# EAGLE design RefrigeradorLG (EAGLE 7.3.0)
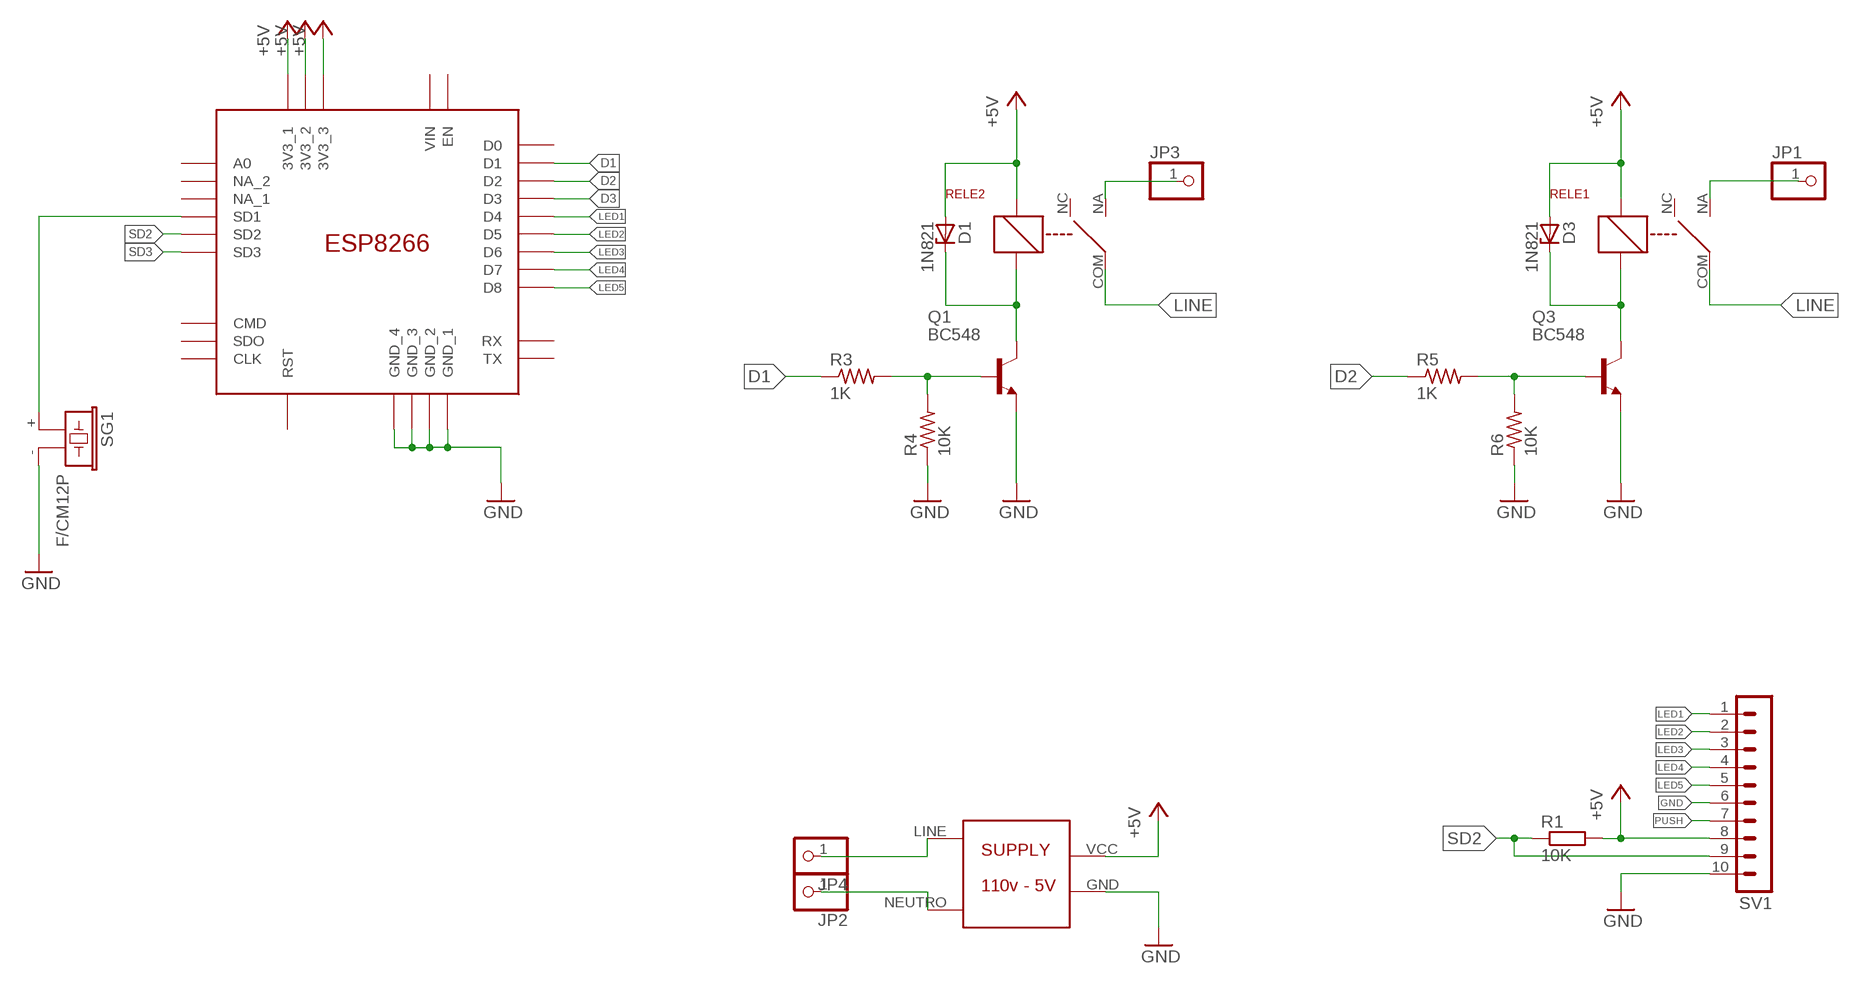
[diagram p0: schematic, sheet 1]

## Parts
D1  1N821  [DO35Z10]
D3  1N821  [DO35Z10]
ESP8266  ESP8266  [ESP8266]
JP1  PINHD-1X1  [1X01]
JP2  PINHD-1X1  [1X01]
JP3  PINHD-1X1  [1X01]
JP4  PINHD-1X1  [1X01]
Q1  BC548  [TO92-EBC]
Q3  BC548  [TO92-EBC]
R1  10K  R-EU_0204/7  [0204/7]
R3  1K  R-US_0204/7  [0204/7]
R4  10K  R-US_0204/7  [0204/7]
R5  1K  R-US_0204/7  [0204/7]
R6  10K  R-US_0204/7  [0204/7]
RELE1  RAS0510  [RAS0510]
RELE2  RAS0510  [RAS0510]
SG1  F/CM12P  [F/CM12P]
SV1  MA10-1  [MA10-1]
U$1  SUPPLY5V  [SUPPLY5V]

## Nets
+5V: D1.A D3.A ESP8266.3V3_1 ESP8266.3V3_2 ESP8266.3V3_3 R1.2 RELE1.B1 RELE2.B1 SV1.8 U$1.VCC
D1: ESP8266.D1 R3.1
D2: ESP8266.D2 R5.1
D3: ESP8266.D3
GND: ESP8266.GND_1 ESP8266.GND_2 ESP8266.GND_3 ESP8266.GND_4 Q1.E Q3.E R4.1 R6.1 SG1.- SV1.6 SV1.10 U$1.GND
LED1: ESP8266.D4 SV1.1
LED2: ESP8266.D5 SV1.2
LED3: ESP8266.D6 SV1.3
LED4: ESP8266.D7 SV1.4
LED5: ESP8266.D8 SV1.5
LINE: JP4.1 RELE1.COM RELE2.COM U$1.LINE
N$1: ESP8266.SD1 SG1.+
N$4: JP2.1 U$1.NEUTRO
N$5: Q1.B R3.2 R4.2
N$6: D1.C Q1.C RELE2.B2
N$7: Q3.B R5.2 R6.2
N$10: D3.C Q3.C RELE1.B2
N$11: JP3.1 RELE2.NA
N$14: JP1.1 RELE1.NA
PUSH: SV1.7
SD2: ESP8266.SD2 R1.1 SV1.9
SD3: ESP8266.SD3
Unconnected: ESP8266.A0 ESP8266.CLK ESP8266.CMD ESP8266.D0 ESP8266.EN ESP8266.NA_1 ESP8266.NA_2 ESP8266.RST ESP8266.RX ESP8266.SDO ESP8266.TX ESP8266.VIN RELE1.NC RELE2.NC

## Library data of the parts
D1 D3 = diode:1N821: Reference DIODE temperature compensated, 6,2 V
ESP8266 = Fortech:ESP8266: Microprocesor WiFi ESP8266
JP1-JP4 = pinhead:PINHD-1X1: PIN HEADER
Q1 Q3 = transistor-npn:BC548*: NPN Transistor
R1 = resistor:R-EU_: RESISTOR, European symbol
R3-R6 = resistor:R-US_: RESISTOR, American symbol
RELE1 RELE2 = E-Lab:RAS0510
SG1 = buzzer:F/CM12P: BUZZER Source: Buerklin; OC_FARNELL: unknown; OC_NEWARK: unknown
SV1 = con-lstb:MA10-1: PIN HEADER; OC_FARNELL: unknown; OC_NEWARK: unknown
U$1 = E-Lab:SUPPLY5V

## Board
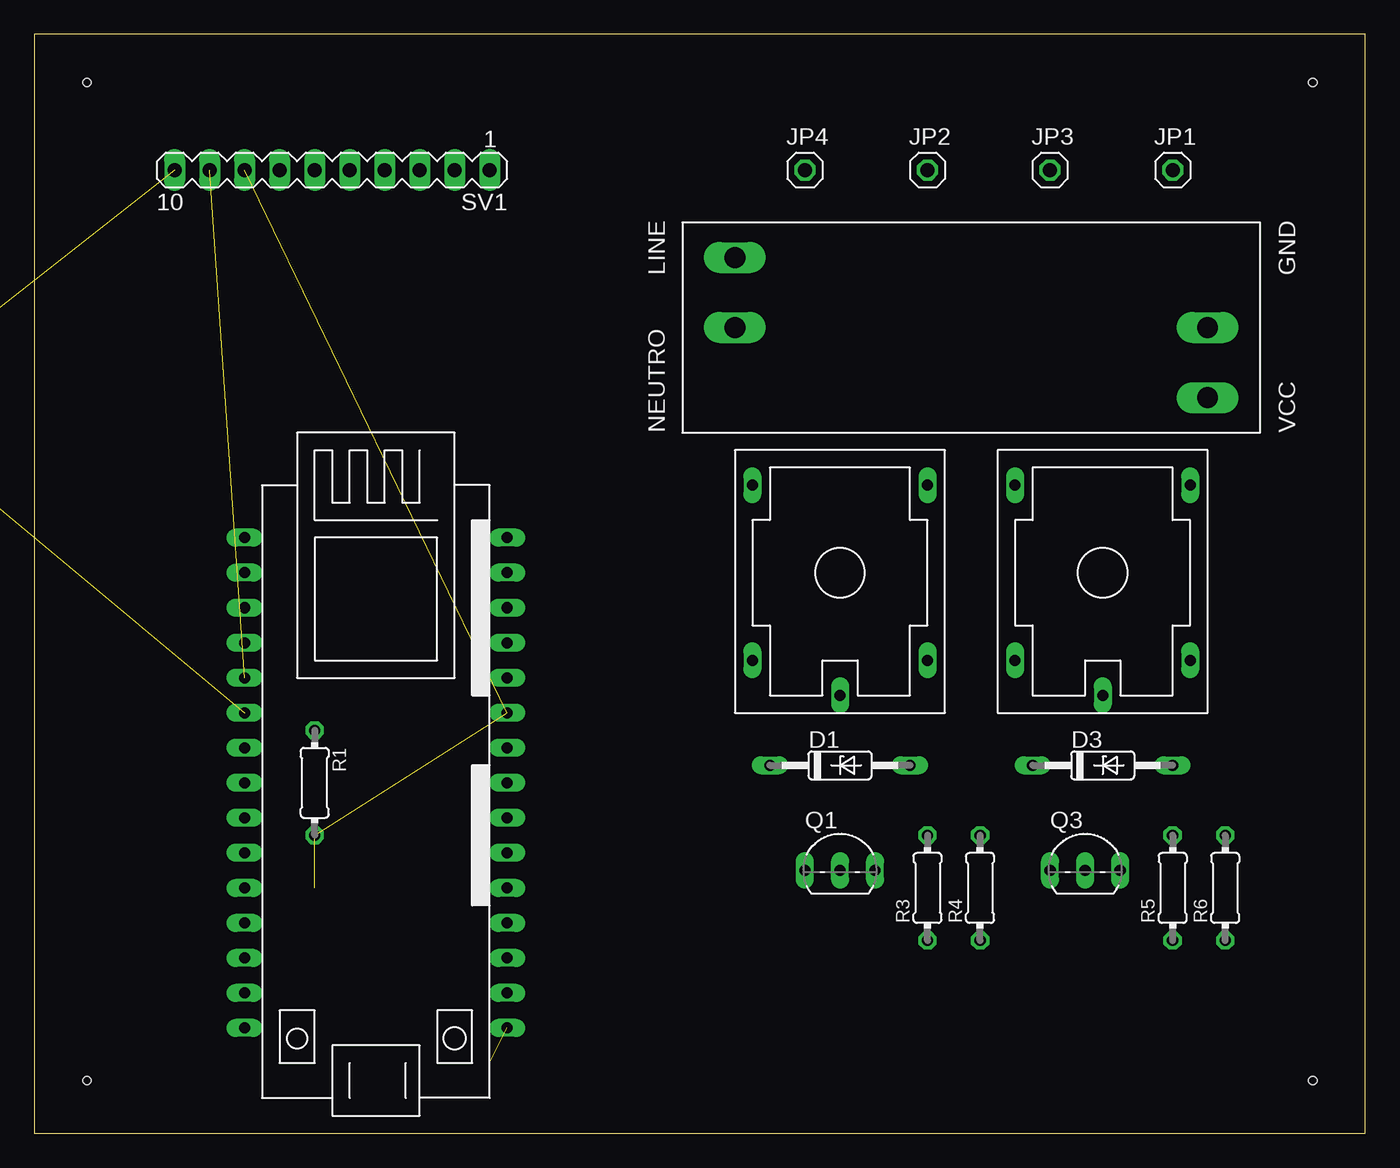
[diagram p1: board, top side]
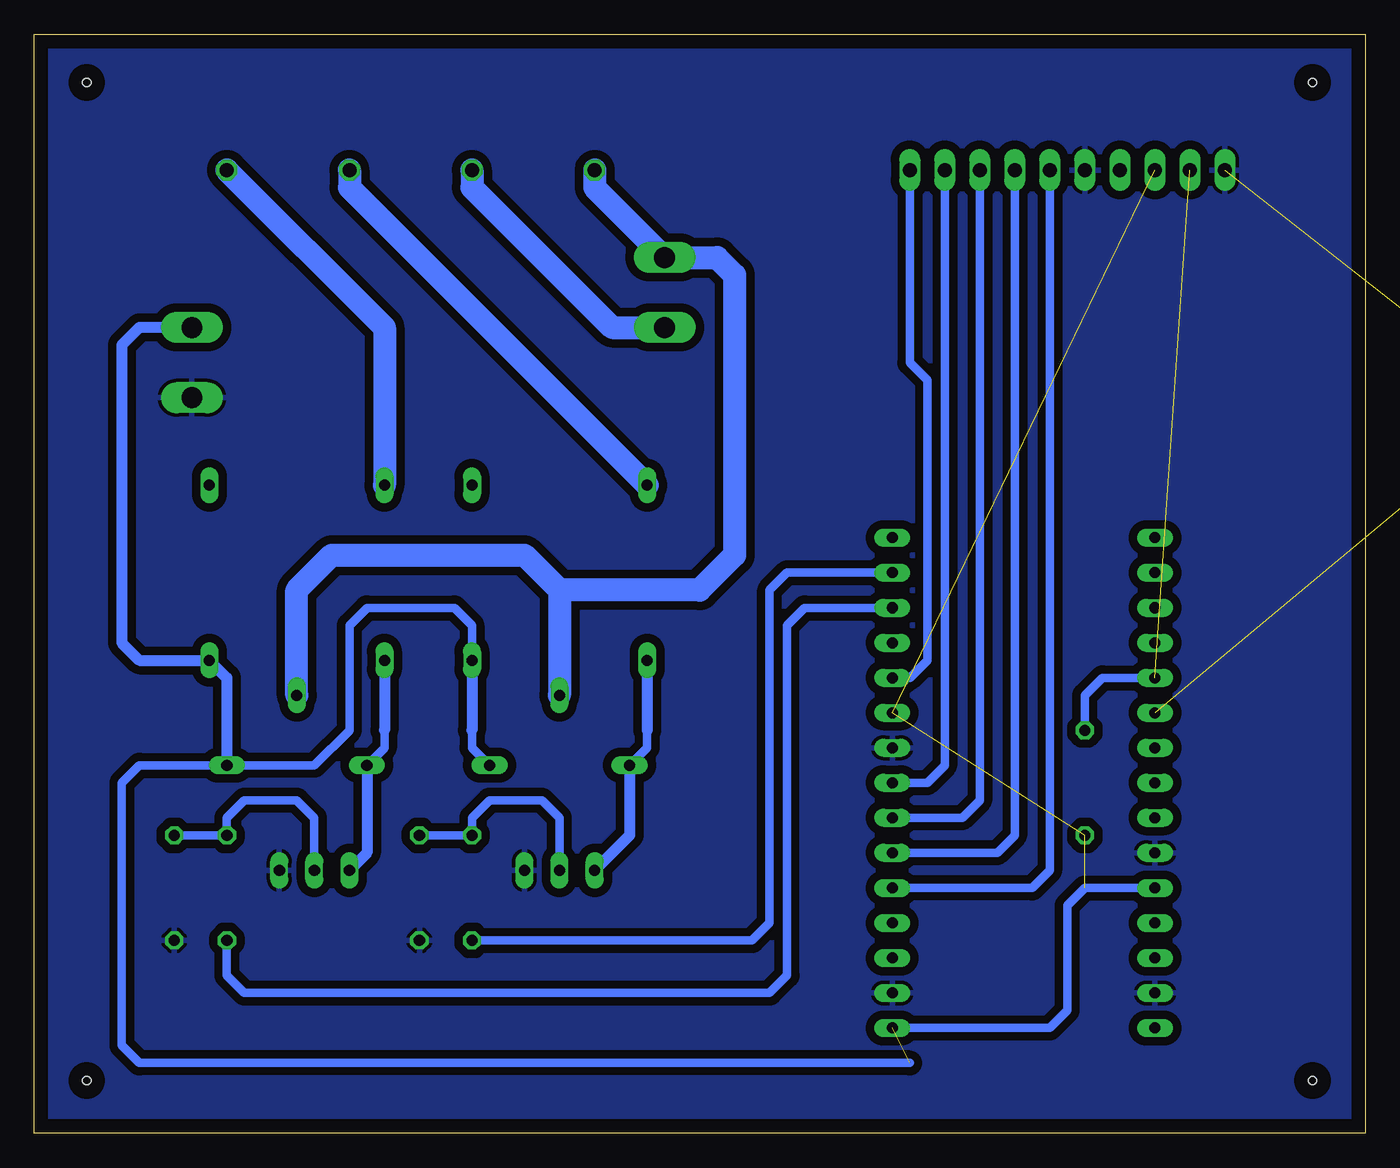
[diagram p2: board, bottom side, seen from below]

Size 96.5 x 79.68 mm. Coordinates in mm from the lower left corner, seen from the top.
Outline: 0,0 96.5,0 96.5,79.68 0,79.68 0,0
Copper layers (1*16): Top 0.035mm / dielectric 1.5mm / Bottom 0.035mm
Design rules "default": minimum track width 10mil, minimum drill 24mil, track to track 8mil, track to pad 8mil, pad to pad 8mil, via to via 8mil, smd to smd 8mil, copper to edge 40mil, drill to drill 8mil, minimum pad ring 10mil, minimum via ring 8mil, stop-mask expansion 4mil, vias tented up to drill 0mil, thermal gap 10mil
Holes 0.6 mm at 3.81,76.2 92.71,76.2 3.81,3.81 92.71,3.81

### Footprints (pad centres in the part's own frame; a part is rotated, then mirrored left to right if it is on the bottom)
DO35Z10 = drill 0.813 long: A 5.08,0; C -5.08,0
ESP8266 = drill 0.8 long: 3V3_1 5.08,-8.89; 3V3_2 -17.78,-8.89; 3V3_3 -7.62,10.16; A0 17.78,10.16; CLK -2.54,10.16; CMD 2.54,10.16; D0 17.78,-8.89; D1 15.24,-8.89; D2 12.7,-8.89; D3 10.16,-8.89; D4 7.62,-8.89; D5 0,-8.89; D6 -2.54,-8.89; D7 -5.08,-8.89; D8 -7.62,-8.89; EN -10.16,10.16; GND_1 2.54,-8.89; GND_2 -15.24,-8.89; GND_3 -15.24,10.16; GND_4 -5.08,10.16; NA_1 12.7,10.16; NA_2 15.24,10.16; RST -12.7,10.16; RX -10.16,-8.89; SD1 5.08,10.16; SD2 7.62,10.16; SD3 10.16,10.16; SDO 0,10.16; TX -12.7,-8.89; VIN -17.78,10.16
1X01 = drill 1.016 octagon: 1 0,0
TO92-EBC = drill 0.813 long: B 0,-1.27; C -2.54,-1.27; E 2.54,-1.27
0204/7 = drill 0.813 octagon: 1 -3.81,0; 2 3.81,0
RAS0510 = drill 0.8 long: B1 -6.35,6.35; B2 6.35,6.35; COM 0,8.89; NA 6.35,-6.35; NC -6.35,-6.35
F/CM12P = drill 1.016 pad 2.54 octagon: + 3.81,0; - -3.81,0
MA10-1 = drill 1.016 long: 1 -11.43,0; 2 -8.89,0; 3 -6.35,0; 4 -3.81,0; 5 -1.27,0; 6 1.27,0; 7 3.81,0; 8 6.35,0; 9 8.89,0; 10 11.43,0
SUPPLY5V = drill 1.5 long: GND 17.78,-5.08; LINE -16.51,5.08; NEUTRO -16.51,0; VCC 17.78,0

### Placement (x,y rotation side)
D1  58.42,26.67 0 top
D3  77.47,26.67 0 top
ESP8266  25.4,25.4 90 top
JP1  82.55,69.85 0 top
JP2  64.77,69.85 0 top
JP3  73.66,69.85 0 top
JP4  55.88,69.85 0 top
Q1  58.42,20.32 0 top
Q3  76.2,20.32 0 top
R1  20.32,25.4 270 top
R3  64.77,17.78 90 top
R4  68.58,17.78 90 top
R5  82.55,17.78 90 top
R6  86.36,17.78 90 top
RELE1  77.47,40.64 180 top
RELE2  58.42,40.64 180 top
SG1  -11.43,55.88 180 top  (outside the outline)
SV1  21.59,69.85 180 top
U$1  67.31,58.42 0 top

### Tracks (layer width: path | path; a pad name or v marks a point on that pad's centre or on a via)
+5V  (4 unrouted)
  Bottom 0.61: RELE2.B1 64.77,36.83 66.04,38.1 72.39,38.1 73.66,36.83 73.66,29.21 76.2,26.67 D3.A 88.9,26.67 90.17,25.4 90.17,6.35 88.9,5.08 33.02,5.08 | 64.77,29.21 64.77,27.94 D1.A | ESP8266.3V3_2 22.86,7.62 21.59,8.89 21.59,16.51 20.32,17.78 ESP8266.3V3_3
  Bottom 0.813: RELE2.B1 64.77,29.21 | D3.A 82.55,33.02 RELE1.B1 88.9,34.29 90.17,35.56 90.17,57.15 88.9,58.42 U$1.VCC
D1
  Bottom 0.61: R3.1 44.45,13.97 43.18,15.24 43.18,39.37 41.91,40.64 ESP8266.D1
D2
  Bottom 0.61: R5.1 82.55,11.43 81.28,10.16 43.18,10.16 41.91,11.43 41.91,36.83 40.64,38.1 ESP8266.D2
GND  (1 unrouted)
  pour Bottom (isolate 0.61): 0,0 0,80.01 96.52,80.01 96.52,0
LED1
  Bottom 0.61: SV1.1 33.02,55.88 31.75,54.61 31.75,34.29 33.02,33.02 ESP8266.D4
LED2
  Bottom 0.61: SV1.2 30.48,26.67 31.75,25.4 ESP8266.D5
LED3
  Bottom 0.61: SV1.3 27.94,24.13 29.21,22.86 ESP8266.D6
LED4
  Bottom 0.61: SV1.4 25.4,21.59 26.67,20.32 ESP8266.D7
LED5
  Bottom 0.61: SV1.5 22.86,19.05 24.13,17.78 ESP8266.D8
LINE
  Bottom 1.676: JP4.1 55.88,68.58 U$1.LINE 46.99,63.5 45.72,62.23 45.72,41.91 48.26,39.37 58.42,39.37 | RELE1.COM 77.47,39.37 74.93,41.91 60.96,41.91 58.42,39.37 | 58.42,39.37 RELE2.COM
N$1  (1 unrouted)
N$4
  Bottom 1.676: JP2.1 64.77,68.58 54.61,58.42 U$1.NEUTRO
N$5
  Bottom 0.61: Q1.B 58.42,22.86 59.69,24.13 63.5,24.13 64.77,22.86 R3.2 R4.2
N$6
  Bottom 0.61: 52.07,29.21 52.07,27.94 D1.C
  Bottom 0.813: RELE2.B2 52.07,29.21 | D1.C 53.34,21.59 Q1.C
N$7
  Bottom 0.61: Q3.B 76.2,22.86 77.47,24.13 81.28,24.13 82.55,22.86 R5.2 R6.2
N$10
  Bottom 0.61: 71.12,29.21 71.12,27.94 D3.C
  Bottom 0.813: RELE1.B2 71.12,29.21 | D3.C 72.39,20.32 Q3.C
N$11
  Bottom 1.676: JP3.1 73.66,68.58 RELE2.NA
N$14
  Bottom 1.676: JP1.1 71.12,58.42 RELE1.NA
SD2  (1 unrouted)
  Bottom 0.61: R1.1 20.32,31.75 19.05,33.02 ESP8266.SD2